# EAGLE design oled_ui (EAGLE 6.6.0)
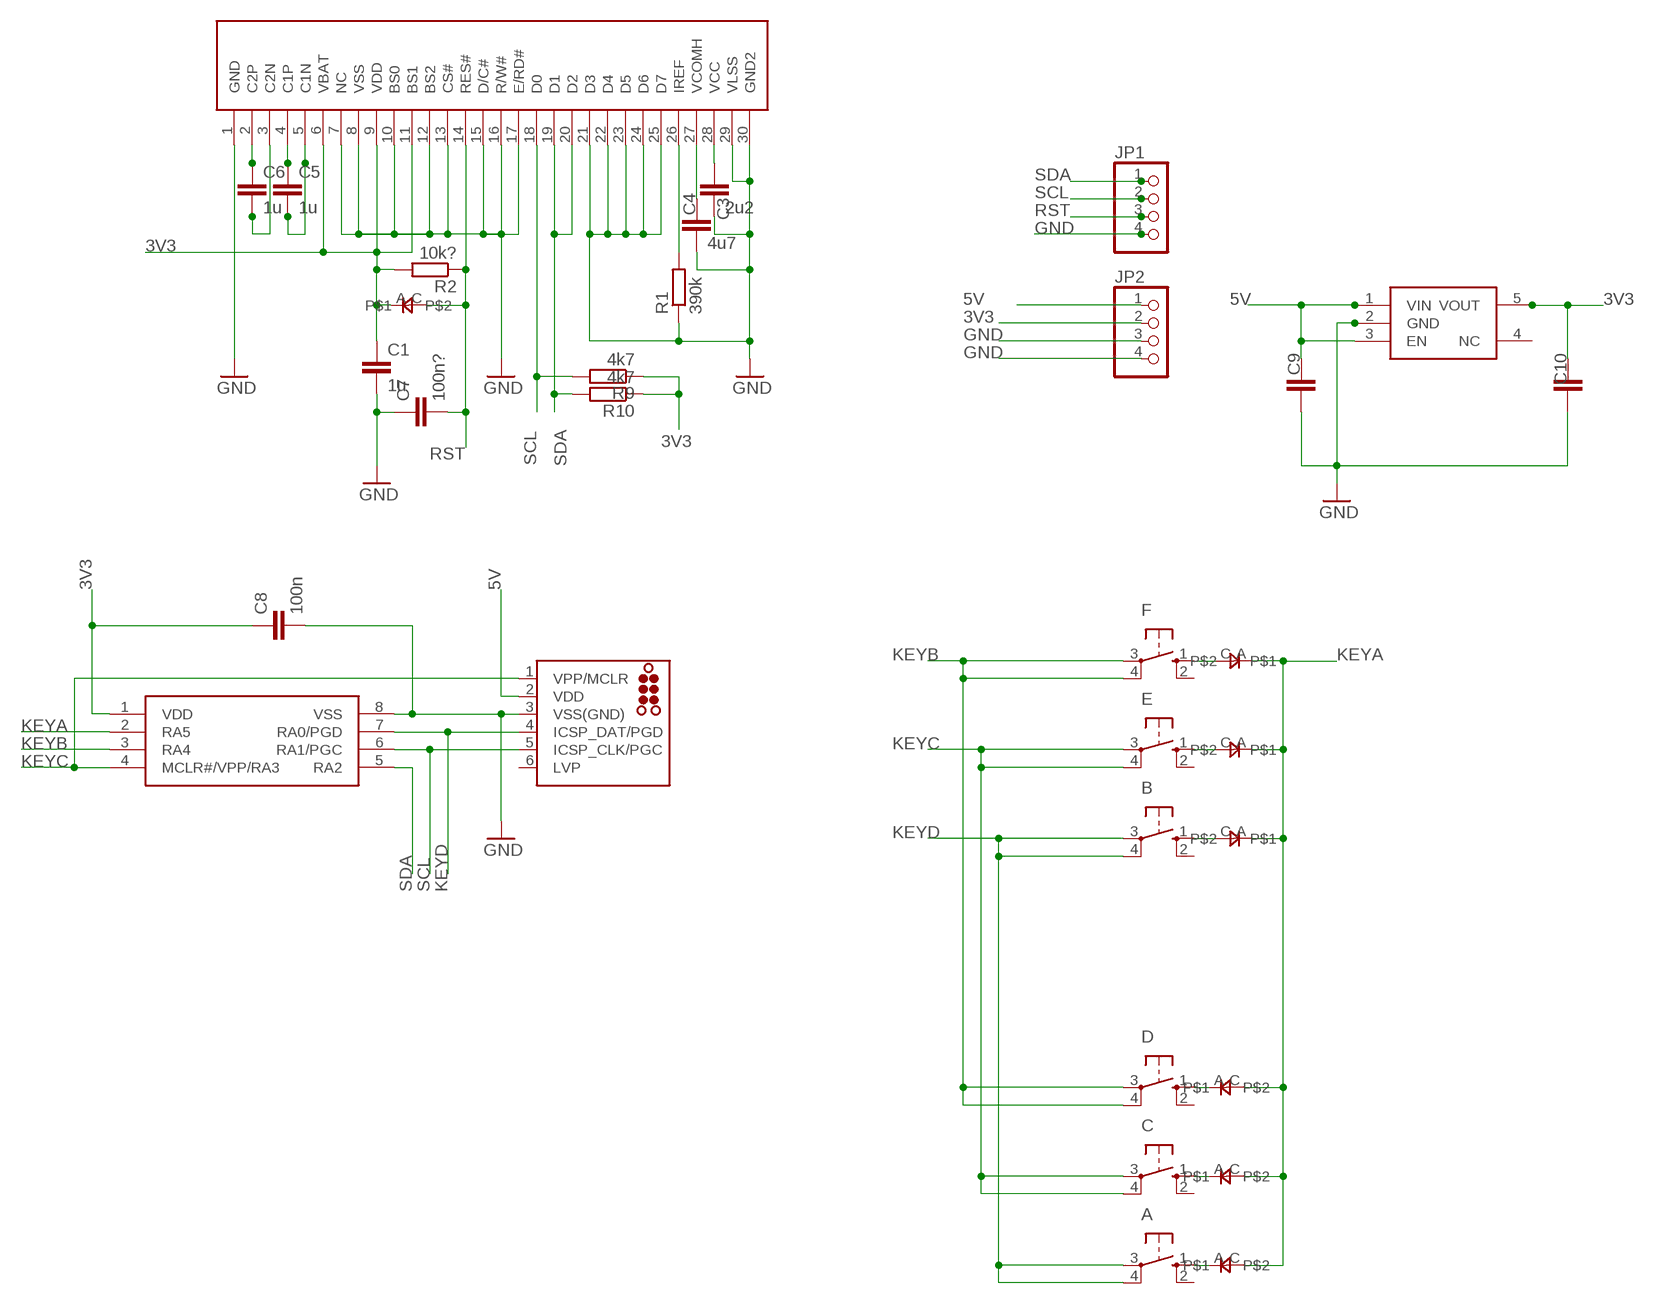
[diagram p0: schematic, sheet 1]

## Parts
A  10-XX  [B3F-10XX]
B  10-XX  [B3F-10XX]
C  10-XX  [B3F-10XX]
C1  1u  C-EUC0805  [C0805]
C3  2u2  C-EUC0805  [C0805]
C4  4u7  C-EUC0805  [C0805]
C5  1u  C-EUC0805  [C0805]
C6  1u  C-EUC0805  [C0805]
C7  100n?  C-EUC0805  [C0805]
C8  100n  C-EUC0805  [C0805]
C9  C-EUC0805  [C0805]
C10  C-EUC0805  [C0805]
D  10-XX  [B3F-10XX]
D1  0805DIODE  [0805DIODE]
E  10-XX  [B3F-10XX]
F  10-XX  [B3F-10XX]
IC1  PIC12F1822SO08  [SO08]
IC2  MIC5504-2.8YM5-TR  [SOT23-5]
ICSP  TC2030-MCP-NL  [TC2030-MCP-NL]
JP1  PINHD-1X4  [1X04]
JP2  PINHD-1X4  [1X04]
R1  390k  R-EU_R0805  [R0805]
R2  10k?  R-EU_R0805  [R0805]
R9  4k7  R-EU_R0805  [R0805]
R10  4k7  R-EU_R0805  [R0805]
U$1  OLED_MODULE  [OLED_CONN]
U$3  0805DIODE  [0805DIODE]
U$4  0805DIODE  [0805DIODE]
U$5  0805DIODE  [0805DIODE]
U$6  0805DIODE  [0805DIODE]
U$7  0805DIODE  [0805DIODE]
U$8  0805DIODE  [0805DIODE]

## Nets
3V3: C1.1 C8.1 C10.1 D1.A IC1.1(VDD) IC2.5(VOUT) JP2.2 R2.2 R9.1 R10.1 U$1.6(VBAT) U$1.9(VDD) U$1.11(BS1)
5V: C9.1 IC2.1(VIN) IC2.3(EN) ICSP.2(VDD) JP2.1
GND: C1.2 C3.2 C4.2 C7.1 C8.2 C9.2 C10.2 IC1.8(VSS) IC2.2(GND) ICSP.3(VSS(GND)) JP1.4 JP2.3 JP2.4 R1.1 U$1.1(GND) U$1.7(NC) U$1.8(VSS) U$1.10(BS0) U$1.12(BS2) U$1.13(CS#) U$1.15(D/C#) U$1.16(R/W#) U$1.17(E/RD#) U$1.21(D3) U$1.22(D4) U$1.23(D5) U$1.24(D6) U$1.25(D7) U$1.29(VLSS) U$1.30(GND2)
KEYA: IC1.2(RA5) U$3.A U$4.A U$5.A U$6.C U$7.C U$8.C
KEYB: D.3(P) D.4(P1) F.3(P) F.4(P1) IC1.3(RA4)
KEYC: C.3(P) C.4(P1) E.3(P) E.4(P1) IC1.4(MCLR#/VPP/RA3) ICSP.1(VPP/MCLR)
KEYD: A.3(P) A.4(P1) B.3(P) B.4(P1) IC1.7(RA0/PGD) ICSP.4(ICSP_DAT/PGD)
N$1: C6.2 U$1.3(C2N)
N$2: C6.1 U$1.2(C2P)
N$3: C5.1 U$1.4(C1P)
N$4: C5.2 U$1.5(C1N)
N$5: F.1(S) U$3.C
N$6: C3.1 U$1.28(VCC)
N$7: D.1(S) U$6.A
N$8: C4.1 U$1.27(VCOMH)
N$9: C.1(S) U$7.A
N$10: R1.2 U$1.26(IREF)
N$11: E.1(S) U$4.C
N$12: B.1(S) U$5.C
N$14: A.1(S) U$8.A
RST: C7.2 D1.C JP1.3 R2.1 U$1.14(RES#)
SCL: IC1.6(RA1/PGC) ICSP.5(ICSP_CLK/PGC) JP1.2 R9.2 U$1.18(D0)
SDA: IC1.5(RA2) JP1.1 R10.2 U$1.19(D1) U$1.20(D2)
Unconnected: A.2(S1) B.2(S1) C.2(S1) D.2(S1) E.2(S1) F.2(S1) IC2.4(NC) ICSP.6(LVP)

## Library data of the parts
A B C D E F = switch-omron:10-XX: OMRON SWITCH; MPN: B3F-1000; OC_FARNELL: 176432; OC_NEWARK: 36M3542
C1 C3-C10 = rcl:C-EU: CAPACITOR, European symbol
D1 U$3-U$8 = jasons_stuff:0805DIODE
IC1 = jasons_stuff:PIC12F1822
IC2 = jason_eagle6:MIC5504-2.8YM5-TR
ICSP = tag-connect:TC2030: TAG-CONNECT ICSP Connector Manufacturer: Tag-Connect <http://www.tag-connect.com> Cable for easy In-Circuit Serial Programming. Designed for Microchip ICD2, suitable for many others. Two variants - one "with legs" (for hands-free fit on PCB) and another "without legs" for quick programming. PAD Description 1 MCLR/Vpp 2 Vdd 3 GND 4 PGD (ISPDAT) 5 PGC (ISPCLK) 6 nc (used for LVP) ©2009 ROFA.cz - modified and updated by Robert Darlington ‹rdarlington@gmail.com›
JP1 JP2 = pinhead:PINHD-1X4: PIN HEADER
R1 R2 R9 R10 = rcl:R-EU_: RESISTOR, European symbol
U$1 = jason_eagle6:OLED_MODULE

## Board
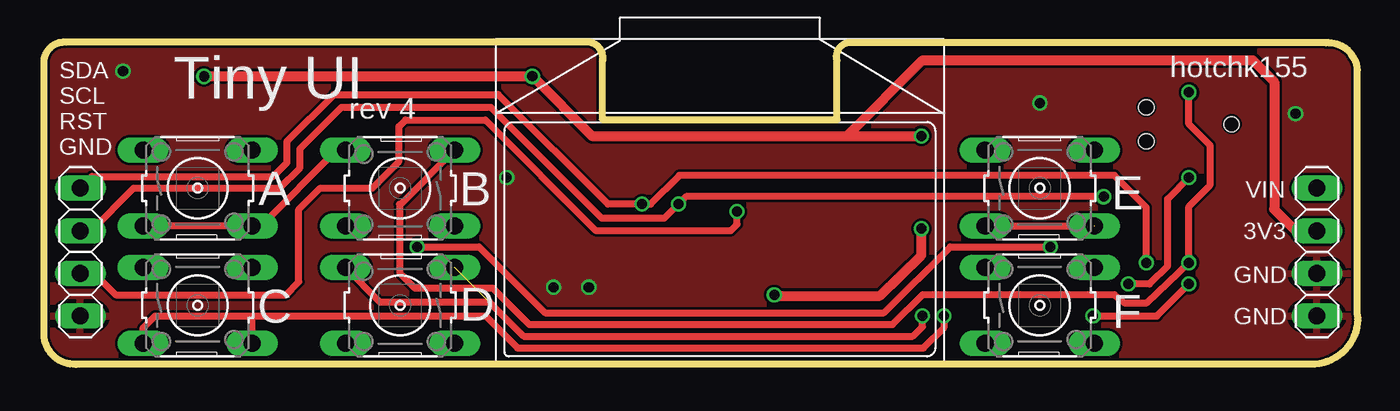
[diagram p1: board, top side]
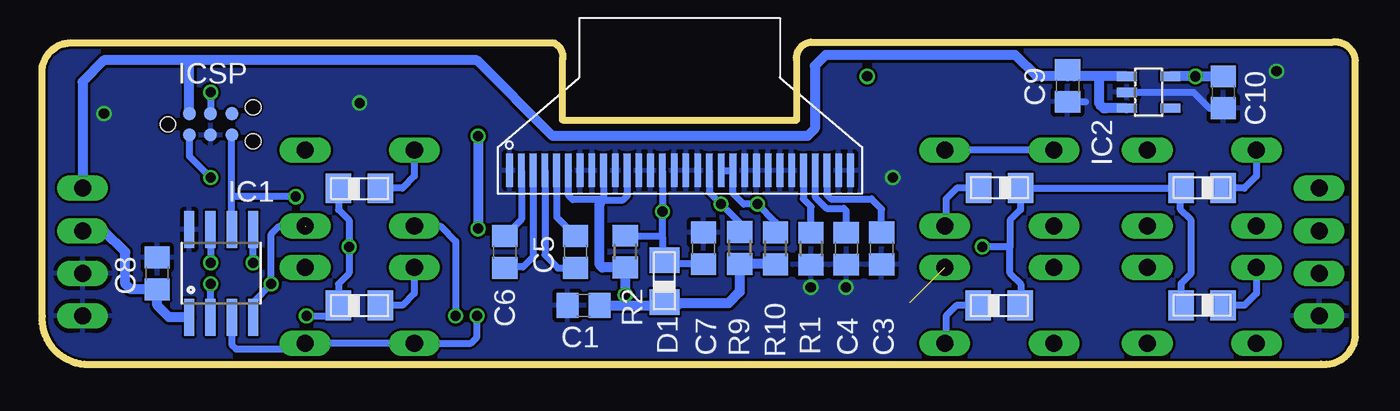
[diagram p2: board, bottom side, seen from below]

Size 78.24 x 19.22 mm. Coordinates in mm from the lower left corner, seen from the top.
Outline: 78.23,2.95 78.23,17.55 arc90 76.38,19.16 47.8,19.16 arc90 47.24,18.12 47.24,14.57 33.27,14.57 33.27,18.12 arc90 32.46,19.22 1.35,19.22 arc90 0,18.12 0,1.61 arc90 2.06,0.01 75.72,0.01 arc90 78.23,2.95
Copper layers (1*16): Top 0.035mm / dielectric 1.5mm / Bottom 0.035mm
Design rules "hackvana": minimum track width 6mil, minimum drill 0.3mm, track to track 6mil, track to pad 9mil, pad to pad 6mil, via to via 6mil, smd to smd 0mil, copper to edge 6mil, drill to drill 6mil, minimum pad ring 10mil, minimum via ring 6mil, stop-mask expansion 2mil, vias tented up to drill 100mil, thermal gap 10mil

### Footprints (pad centres in the part's own frame; a part is rotated, then mirrored left to right if it is on the bottom)
B3F-10XX = drill 1.016 long: 1 -3.251,2.261; 2 3.251,2.261; 3 -3.251,-2.261; 4 3.251,-2.261
C0805 = smd 1.3 x 1.5: 1 -0.95,0; 2 0.95,0
0805DIODE = smd 1.524 x 1.778: A -1.262,-0.005; C 1.238,-0.005
SO08 = smd 0.61 x 2.21: 1 -1.905,-2.616; 2 -0.635,-2.616; 3 0.635,-2.616; 4 1.905,-2.616; 5 1.905,2.616; 6 0.635,2.616; 7 -0.635,2.616; 8 -1.905,2.616
SOT23-5 = smd 0.55 x 1.2: 1 -0.95,-1.3; 2 0,-1.3; 3 0.95,-1.3; 4 0.95,1.3; 5 -0.95,1.3
TC2030-MCP-NL = smd 0.787 x 0.787: 1 1.27,-0.635; 2 1.27,0.635; 3 2.54,-0.635; 4 2.54,0.635; 5 3.81,-0.635; 6 3.81,0.635 | hole 0.889: 0,0; 5.08,-1.016; 5.08,1.016
1X04 = drill 1.016 long: 1 -3.81,0; 2 -1.27,0; 3 1.27,0; 4 3.81,0
R0805 = smd 1.3 x 1.5: 1 -0.95,0; 2 0.95,0
OLED_CONN = smd 0.4 x 2 bottom: 1 3.211,14.81; 2 3.911,14.81; 3 4.611,14.81; 4 5.311,14.81; 5 6.011,14.81; 6 6.711,14.81; 7 7.411,14.81; 8 8.111,14.81; 9 8.811,14.81; 10 9.511,14.81; 11 10.211,14.81; 12 10.911,14.81; 13 11.611,14.81; 14 12.311,14.81; 15 13.011,14.81; 16 13.711,14.81; 17 14.411,14.81; 18 15.111,14.81; 19 15.811,14.81; 20 16.511,14.81; 21 17.211,14.81; 22 17.911,14.81; 23 18.611,14.81; 24 19.311,14.81; 25 20.011,14.81; 26 20.711,14.81; 27 21.411,14.81; 28 22.111,14.81; 29 22.811,14.81; 30 23.511,14.81

### Placement (x,y rotation side)
A  9.14,10.5 0 top
B  21.21,10.5 180 top
C  9.14,3.52 0 top
C1  45.97,3.52 180 bottom
C3  28.22,6.91 270 bottom
C4  30.33,6.9 270 bottom
C5  46.46,6.71 90 bottom
C6  50.67,6.71 270 bottom
C7  38.84,6.92 270 bottom
C8  71.37,5.42 90 bottom
C9  17.14,16.6 270 bottom
C10  7.87,16.22 270 bottom
D  21.21,3.52 180 top
D1  41.16,4.97 90 bottom
E  59.31,10.5 0 top
F  59.31,3.52 0 top
IC1  67.56,5.42 0 bottom
IC2  12.32,16.22 270 bottom
ICSP  70.74,14.31 0 bottom
JP1  2.16,6.69 270 top
JP2  75.82,6.69 270 top
R1  32.42,6.9 90 bottom
R2  43.5,6.72 270 bottom
R9  36.68,6.93 90 bottom
R10  34.54,6.91 90 bottom
U$1  53.59,26.38 180 top
U$3  59.31,3.52 0 bottom
U$4  59.31,10.5 0 bottom
U$5  21.21,10.5 180 bottom
U$6  21.21,3.52 0 bottom
U$7  9.14,3.52 180 bottom
U$8  9.14,10.5 180 bottom

### Tracks (layer width: path | path; a pad name or v marks a point on that pad's centre or on a via)
3V3  (via drill 0.6)
  Top 0.61: 47.81,13.62 32.64,13.62 v29.08,17.17 v9.53,17.17 | 47.81,13.62 52.32,18.12 72.01,18.12 73.28,16.85 73.28,9.23 74.55,7.96 JP2.2 | 47.81,13.62 v52.26,13.62 | v52.26,8.09 52.26,6.5 49.78,4.09 43.64,4.09 v43.5,4.14
  Bottom 0.406: 45.02,9.55 44.77,9.81 | 44.77,9.81 43.62,9.81 43.38,10.05 U$1.11 | U$1.9 44.78,9.82 | 44.78,9.82 44.77,9.81 | 44.78,9.82 46.62,9.82 46.86,10.06 46.86,11.55 U$1.6 | 45.15,3.7 45.34,3.52 C1.1 | 34.57,5.98 R10.1 | D1.A | C8.1
  Bottom 0.61: IC2.5 v9.53,17.17 C10.1 | IC1.1 70.66,2.81 71.37,3.52 C8.1 72.96,4.47 73.28,4.79 73.28,6.69 74.55,7.96 JP2.2 | 40.26,3.65 41.1,3.65 D1.A | 34.57,5.98 R9.1 36.68,4.31 37.34,3.65 40.26,3.65 | C1.1 43.43,3.52 | 43.43,3.52 40.39,3.52 40.26,3.65 | 43.43,3.52 43.5,3.58 v43.5,4.14 R2.2 44.86,5.77 45.02,5.93 45.02,9.55 | v52.26,13.62 v52.26,8.09
5V
  Bottom 0.406: 17.14,17.17 C9.1
  Bottom 0.61: IC2.3 14.86,15.27 14.99,15.27 15.24,15.52 15.24,17.17 | IC2.1 15.24,17.17 | 15.24,17.17 16.76,17.17 C9.1 | 17.14,17.17 18.98,17.17 20.26,18.44 31.56,18.44 32.19,17.81 32.19,14.06 32.64,13.62 47.81,13.62 52.32,18.12 69.47,18.12 | 69.47,18.12 74.55,18.12 75.82,16.85 JP2.1 | ICSP.2 69.47,18.12
GND  (via drill 0.6)
  Bottom 0.406: IC2.2 9.65,16.22 8.7,15.27 C10.2 | C9.2 16.06,15.65
  other vias: 4.7,17.49 59.31,15.58 74.55,14.95 27.56,11.14 30.35,4.6 32.45,4.6
  pour Bottom: -3.56,22.57 -3.56,-1.56 82.17,-1.56 82.17,25.11 -3.56,25.11
  pour Top: -2.29,21.3 -2.29,-2.83 81.53,-2.83 81.53,22.57 -2.29,22.57
KEYA  (via drill 0.6)
  Top 0.406: v22.23,7.01 25.91,7.01 29.84,3.07 50.04,3.07 53.98,7.01 v59.94,7.01 | v62.48,2.88 66.29,2.88 v68.2,4.79
  Bottom 0.406: U$4.A 60.57,9.23 59.94,8.6 v59.94,7.01 59.94,5.42 60.58,4.79 U$3.A | U$7.C 10.38,4.82 9.78,5.42 9.78,8.6 10.41,9.23 10.41,10.48 | 10.41,10.48 U$8.C | 20.57,7.01 20.57,8.6 19.95,9.23 U$5.A 19.91,10.48 10.41,10.48 | U$6.C 19.94,3.55 19.94,4.79 20.57,5.42 20.57,7.01 | 20.57,7.01 v22.23,7.01 | IC1.2 v68.2,4.79 | U$3.A | v62.48,2.88 61.2,2.88 U$3.A
KEYB  (via drill 0.6)  (1 unrouted)
  Top 0.406: D.4 20.03,3.71 26.54,3.71 28.57,1.68 51.75,1.68 52.32,2.25 v52.32,2.88
  Bottom 0.406: IC1.3 66.93,1.17 66.67,0.91 62.9,0.91 F.4 F.3 52.68,1.26 52.32,1.61 v52.32,2.88
KEYC  (via drill 0.6)  (1 unrouted)
  Top 0.406: C.3 5.89,2.17 6.6,2.88 12.32,2.88 | 12.32,2.88 26.29,2.88 28.19,0.98 52.39,0.98 53.59,2.18 v53.59,2.88 | v64.58,4.79 65.85,4.79 66.93,5.87 66.93,9.87 v68.2,11.14 | C.4 12.4,2.81 12.32,2.88 | E.3 E.4
  Bottom 0.406: E.3 54.51,8.24 53.59,7.33 v53.59,2.88 | 62.54,8.22 64.13,8.22 64.58,7.77 v64.58,4.79 65.66,3.71 IC1.4 | ICSP.1 69.47,12.41 v68.2,11.14
KEYD  (via drill 0.6)
  Top 0.406: 21.21,9.51 21.21,5.42 22.1,4.53 26.73,4.53 28.89,2.38 50.55,2.38 52.32,4.15 63.75,4.15 64.39,3.65 65.66,3.65 v68.2,6.06 68.2,9.42 69.47,10.69 69.47,13.04 68.2,14.31 v68.2,16.22 | 21.21,9.51 B.3 | 21.17,9.55 21.21,9.51 | B.4 17.44,12.76 12.92,8.24 A.4 A.3
  Bottom 0.406: IC1.7 v68.2,6.06 | v68.2,16.22 ICSP.4 | B.4 B.3
N$1
  Bottom 0.406: U$1.3 48.98,6.42 49.59,5.8 50.62,5.8 C6.2
N$2
  Bottom 0.406: U$1.2 49.68,8.65 C6.1
N$3
  Bottom 0.406: U$1.4 48.28,6.53 47.5,5.74 46.47,5.74 C5.1
N$4
  Bottom 0.406: U$1.5 47.58,8.78 C5.2
N$5
  Bottom 0.406: F.1 56.06,4.23 56.77,3.52 U$3.C
N$6
  Bottom 0.406: U$1.28 31.48,10.11 31.24,9.87 28.83,9.87 28.22,9.26 C3.1
N$7
  Bottom 0.406: U$6.A 23.75,3.51 24.38,2.88 24.38,1.33 D.1
N$8
  Bottom 0.406: C4.1 30.33,9.14 30.48,9.3 31.5,9.3 32.18,9.98 U$1.27
N$9
  Bottom 0.406: C.1 5.89,4.23 6.6,3.52 U$7.A
N$10
  Bottom 0.406: U$1.26 32.88,9.86 32.42,9.4 R1.2
N$11
  Bottom 0.406: E.1 56.06,11.21 56.77,10.5 U$4.C
N$12
  Bottom 0.406: U$5.C 23.74,10.51 24.38,9.87 24.38,8.32 B.1
N$14
  Bottom 0.406: A.1 5.89,11.21 6.6,10.5 U$8.A
RST  (via drill 0.6)
  Top 0.406: JP1.3 2.98,5.42 4.26,4.15 14.41,4.15 15.18,4.92 15.18,9.23 16.45,10.5 19.56,10.5 21.15,12.09 21.15,14.19 21.53,14.57 26.29,14.57 32.89,7.96 40.89,7.96 41.28,8.35 v41.28,9.1 v41.27,9.11
  Bottom 0.406: C7.2 40.92,5.97 D1.C 41.28,6.33 41.28,7.58 | U$1.14 v41.28,9.1 | R2.1 41.37,7.67 41.28,7.58 | 41.28,7.58 v41.28,9.1 | v41.28,9.1 v41.27,9.11
SCL  (via drill 0.6)
  Top 0.406: JP1.2 2.79,7.96 5.33,10.5 14.03,10.5 15.24,11.71 15.24,12.85 17.72,15.33 26.61,15.33 33.21,8.73 36.96,8.73 v37.78,9.55 38.23,10 v63.12,10
  Bottom 0.406: U$1.18 38.48,10.25 v37.78,9.55 36.68,8.45 R9.2 | IC1.6 66.93,10 | 66.93,10 ICSP.5 | v63.12,10 66.93,10
SDA  (via drill 0.6)
  Top 0.406: JP1.1 2.86,11.2 13.65,11.2 14.48,12.03 14.48,13.3 17.27,16.09 27.05,16.09 33.59,9.55 v35.62,9.55 36.13,9.55 37.85,11.27 63.75,11.27 65.66,9.36 v65.66,6.06
  Bottom 0.406: U$1.19 U$1.20 37.08,10.19 36.45,9.55 v35.62,9.55 34.54,8.47 R10.2 | v65.66,6.06 IC1.5

### Text on the board
tNames: hotchk155 | Tiny UI | rev 4 | SDA / SCL / RST / GND | VIN | 3V3 | GND | GND